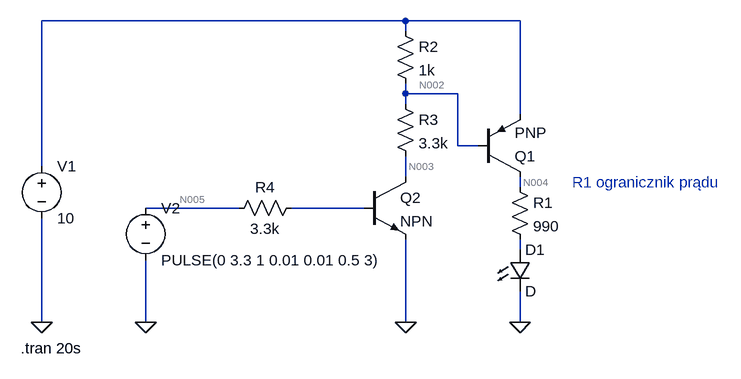
[diagram p0: schematic schemat3.asc]
schemat3.asc, the LTspice schematic file:
Version 4
SHEET 1 880 680
WIRE -368 -240 -928 -240
WIRE -192 -240 -368 -240
WIRE -368 -224 -368 -240
WIRE -368 -128 -368 -144
WIRE -288 -128 -368 -128
WIRE -368 -112 -368 -128
WIRE -192 -96 -192 -240
WIRE -288 -48 -288 -128
WIRE -256 -48 -288 -48
WIRE -928 -16 -928 -240
WIRE -368 0 -368 -32
WIRE -192 16 -192 0
WIRE -624 48 -768 48
WIRE -432 48 -544 48
WIRE -192 112 -192 96
WIRE -928 224 -928 64
WIRE -768 224 -768 128
WIRE -368 224 -368 96
WIRE -192 224 -192 176
FLAG -928 224 0
FLAG -192 224 0
FLAG -368 224 0
FLAG -768 224 0
SYMBOL voltage -928 -32 R0
WINDOW 123 0 0 Left 0
WINDOW 39 0 0 Left 0
SYMATTR InstName V1
SYMATTR Value 10
SYMBOL voltage -768 32 R0
WINDOW 123 0 0 Left 0
WINDOW 39 0 0 Left 0
SYMATTR InstName V2
SYMATTR Value PULSE(0 3.3 1 0.01 0.01 0.5 3)
SYMBOL res -208 0 R0
SYMATTR InstName R1
SYMATTR Value 990
SYMBOL pnp -256 0 M180
SYMATTR InstName Q1
SYMBOL LED -208 112 R0
SYMATTR InstName D1
SYMBOL npn -432 0 R0
SYMATTR InstName Q2
SYMBOL res -384 -240 R0
SYMATTR InstName R2
SYMATTR Value 1k
SYMBOL res -384 -128 R0
SYMATTR InstName R3
SYMATTR Value 3.3k
SYMBOL res -528 32 R90
WINDOW 0 0 56 VBottom 2
WINDOW 3 32 56 VTop 2
SYMATTR InstName R4
SYMATTR Value 3.3k
TEXT -960 264 Left 2 !.tran 20s
TEXT -112 8 Left 2 ;R1 ogranicznik prądu

The netlist it stands for:
* schemat3.asc
V1 N001 0 10
V2 N005 0 PULSE(0 3.3 1 0.01 0.01 0.5 3)
R1 N004 N007 990
Q1 N004 N002 N001 0 PNP
D1 N007 0 D
Q2 N003 N006 0 0 NPN
R2 N001 N002 1k
R3 N002 N003 3.3k
R4 N006 N005 3.3k
.model D D
.lib standard.dio
.model NPN NPN
.model PNP PNP
.lib standard.bjt
.tran 20s
* R1 ogranicznik prądu
.backanno
.end

* Results of the author's LTspice run, read from the files saved beside the schematic
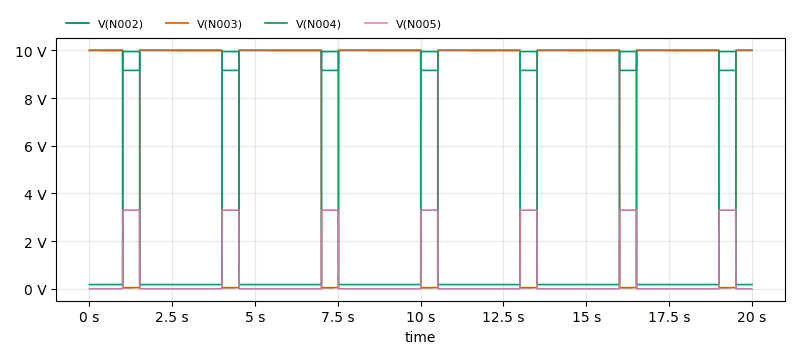
[diagram p1: Transient Analysis of schemat3.asc, plotted from the saved traces]
* Transient Analysis, 1 run:
*   V(N002): min 9.16 V, max 10 V, average 9.848 V, rms 9.854 V, last 10 V
*   V(N003): min 45.78 mV, max 10 V, average 8.206 V, rms 9.054 V, last 10 V
*   V(N004): min 177.5 mV, max 9.949 V, average 1.939 V, rms 4.227 V, last 177.8 mV
*   V(N005): min 0 V, max 3.3 V, average 589 mV, rms 1.39 V, last 0 V